# EAGLE design rack (EAGLE 7.2.0)
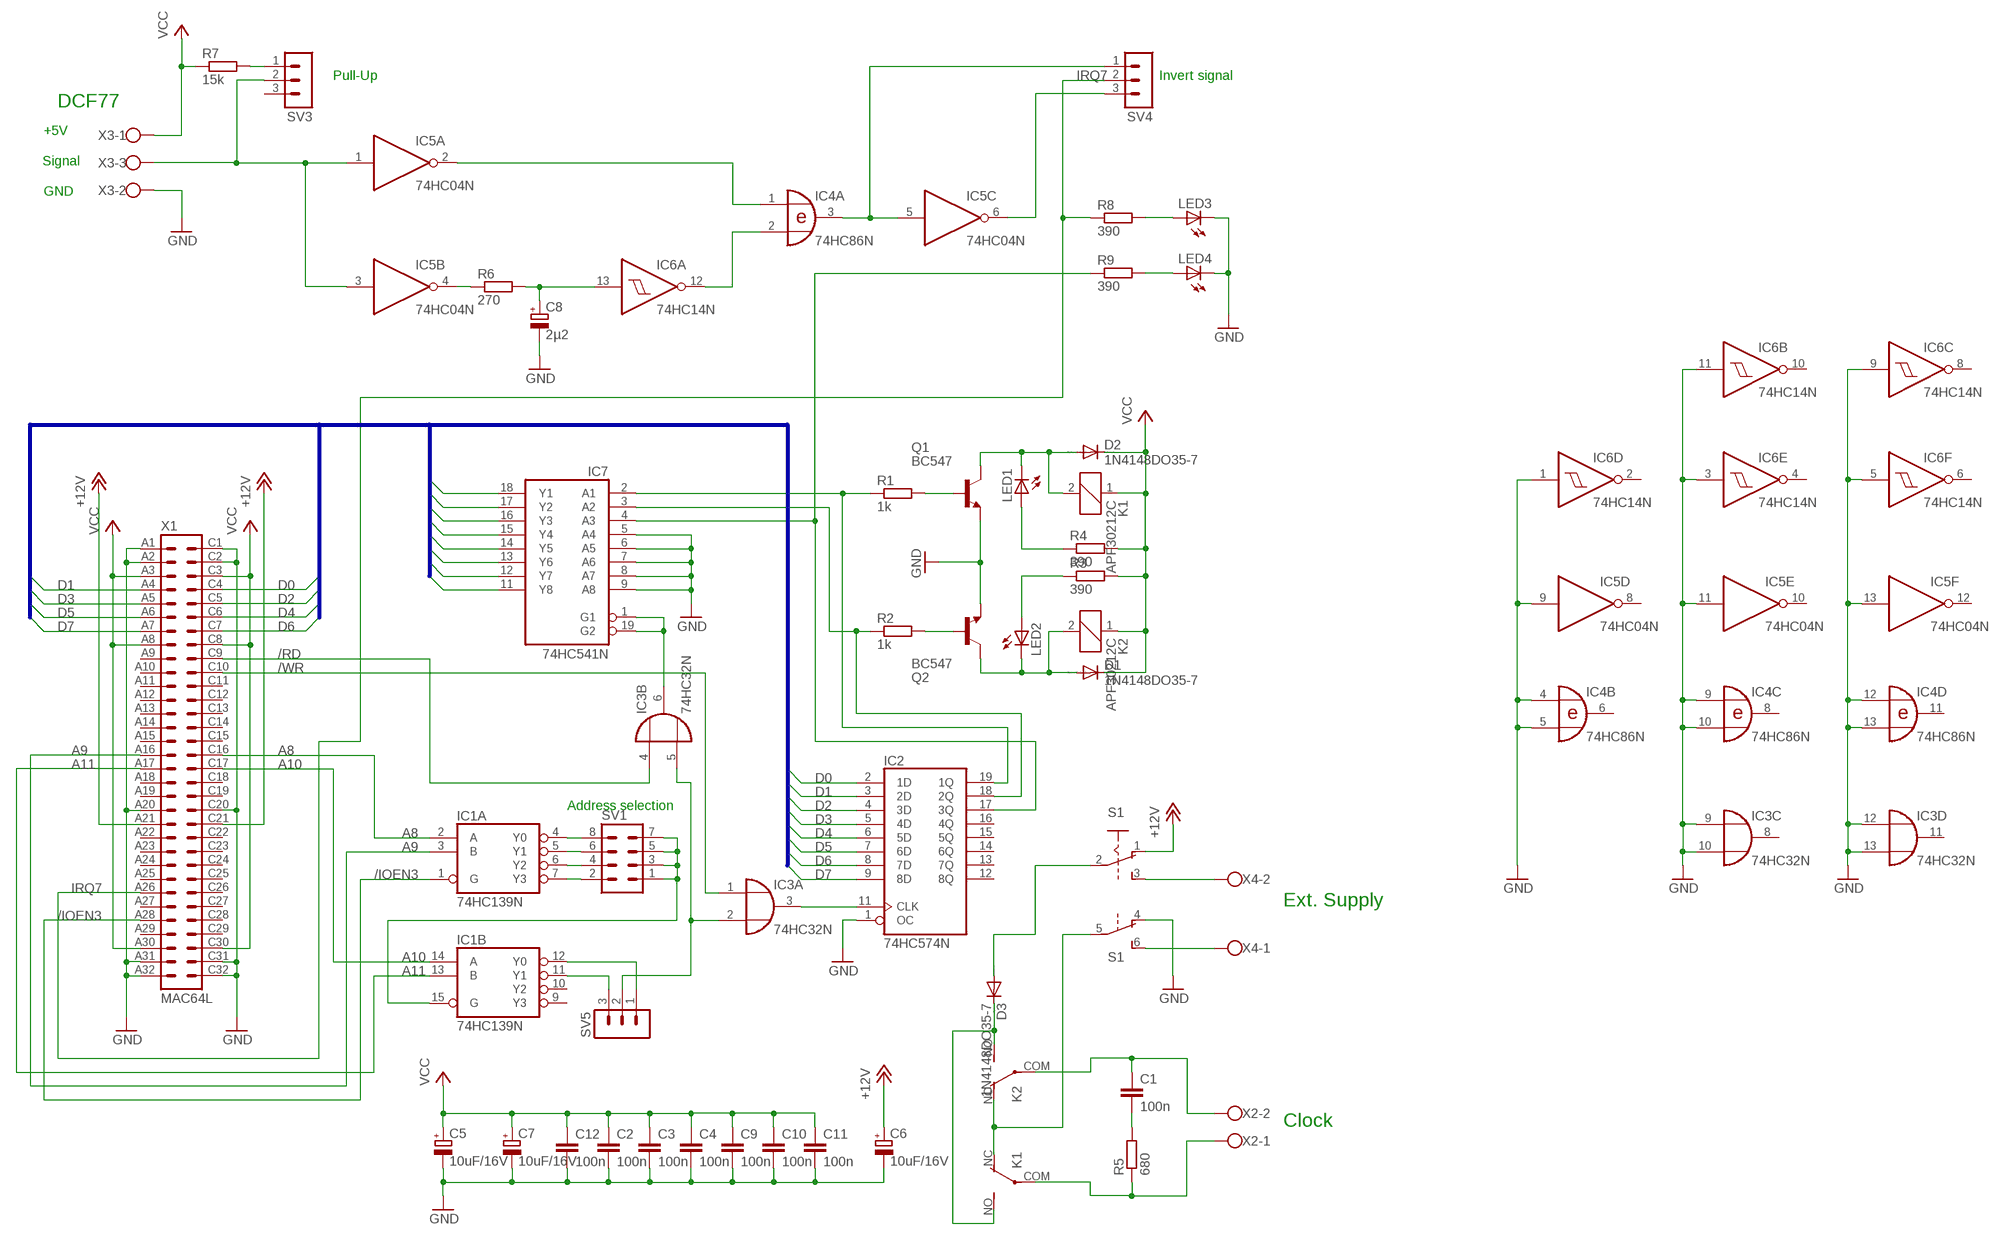
[diagram p0: schematic, sheet 1]

## Parts
C1  100n  C-EU050-024X044  [C050-024X044]
C2  100n  C-EU050-024X044  [C050-024X044]
C3  100n  C-EU050-024X044  [C050-024X044]
C4  100n  C-EU050-024X044  [C050-024X044]
C5  10uF/16V  CPOL-EUTT2D5  [TT2D5]
C6  10uF/16V  CPOL-EUTT2D5  [TT2D5]
C7  10uF/16V  CPOL-EUTT2D5  [TT2D5]
C8  2µ2  CPOL-EUE2,5-6E  [E2,5-6E]
C9  100n  C-EU050-024X044  [C050-024X044]
C10  100n  C-EU050-024X044  [C050-024X044]
C11  100n  C-EU050-024X044  [C050-024X044]
C12  100n  C-EU050-024X044  [C050-024X044]
D1  1N4148DO35-7  [DO35-7]
D2  1N4148DO35-7  [DO35-7]
D3  1N4148DO35-7  [DO35-7]
IC1  74HC139N  [DIL16]
IC2  74HC574N  [DIL20]
IC3  74HC32N  [DIL14]
IC4  74HC86N  [DIL14]
IC5  74HC04N  [DIL14]
IC6  74HC14N  [DIL14]
IC7  74HC541N  [DIL20]
K1  APF30212C  [APF30212C]
K2  APF30212C  [APF30212C]
LED1  LEDB155  [Q62902-B155]
LED2  LEDB155  [Q62902-B155]
LED3  LEDB155  [Q62902-B155]
LED4  LEDB155  [Q62902-B155]
Q1  BC547  [TO92]
Q2  BC547  [TO92]
R1  1k  R-EU_0204/7  [0204/7]
R2  1k  R-EU_0204/7  [0204/7]
R3  390  R-EU_0204/7  [0204/7]
R4  390  R-EU_0204/7  [0204/7]
R5  680  R-EU_0204/7  [0204/7]
R6  270  R-EU_0204/7  [0204/7]
R7  15k  R-EU_0204/7  [0204/7]
R8  390  R-EU_0204/7  [0204/7]
R9  390  R-EU_0204/7  [0204/7]
S1  A68-A31  [A68-A31]
SV1  MA04-2  [MA04-2]
SV3  MA03-1  [MA03-1]
SV4  MA03-1  [MA03-1]
SV5  MA03-1  [MA03-1]
X1  MAC64L  [MAC64L]
X2  W237-102  [W237-102]
X3  W237-103  [W237-103]
X4  W237-102  [W237-102]

## Nets
+12V: C6.+ S1.1(A:O) X1.A21 X1.C21
/IOEN3: IC1.1(A:G) X1.A28
/RD: IC3.4(B:I0) X1.C9
/WR: IC3.1(A:I0) X1.C10
A8: IC1.2(A:A) X1.C16
A9: IC1.3(A:B) X1.A16
A10: IC1.14(B:A) X1.C17
A11: IC1.13(B:B) X1.A17
D0: IC2.2(1D) IC7.18(Y1) X1.C4
D1: IC2.3(2D) IC7.17(Y2) X1.A4
D2: IC2.4(3D) IC7.16(Y3) X1.C5
D3: IC2.5(4D) IC7.15(Y4) X1.A5
D4: IC2.6(5D) IC7.14(Y5) X1.C6
D5: IC2.7(6D) IC7.13(Y6) X1.A6
D6: IC2.8(7D) IC7.12(Y7) X1.C7
D7: IC2.9(8D) IC7.11(Y8) X1.A7
GND: C2.2 C3.2 C4.2 C5.- C6.- C7.- C8.- C9.2 C10.2 C11.2 C12.2 IC2.1(OC) IC3.9(C:I0) IC3.10(C:I1) IC3.12(D:I0) IC3.13(D:I1) IC4.4(B:I0) IC4.5(B:I1) IC4.9(C:I0) IC4.10(C:I1) IC4.12(D:I0) IC4.13(D:I1) IC5.9(D:I) IC5.11(E:I) IC5.13(F:I) IC6.1(D:I) IC6.3(E:I) IC6.5(F:I) IC6.9(C:I) IC6.11(B:I) IC7.5(A4) IC7.6(A5) IC7.7(A6) IC7.8(A7) IC7.9(A8) LED3.K(C) LED4.K(C) Q1.1(E) Q2.1(E) S1.4(B:O) X1.A1 X1.A2 X1.A20 X1.A31 X1.A32 X1.C1 X1.C2 X1.C20 X1.C31 X1.C32 X3.2
IRQ7: R8.1 SV4.2 X1.A26
N$1: IC1.4(A:Y0) SV1.8
N$2: IC1.5(A:Y1) SV1.6
N$3: IC1.6(A:Y2) SV1.4
N$4: IC1.7(A:Y3) SV1.2
N$5: IC2.17(3Q) IC7.4(A3) R9.1
N$6: IC1.11(B:Y1) SV5.3
N$7: IC1.12(B:Y0) SV5.1
N$8: IC1.15(B:G) SV1.1 SV1.3 SV1.5 SV1.7
N$9: IC2.11(CLK) IC3.3(A:O)
N$10: Q1.2(B) R1.2
N$11: IC2.19(1Q) IC7.2(A1) R1.1
N$12: IC2.18(2Q) IC7.3(A2) R2.1
N$13: Q2.2(B) R2.2
N$14: D2.A K1.2 LED1.K(C) Q1.3(C)
N$15: C1.2 R5.2
N$16: D1.A K2.2 LED2.K(C) Q2.3(C)
N$17: C1.1 K2.COM(2:P) X2.2
N$18: LED1.A R4.1
N$19: LED2.A R3.1
N$20: K1.COM(2:P) R5.1 X2.1
N$21: D3.C K1.NO(2:S) K2.NO(2:S)
N$22: IC5.4(B:O) R6.1
N$23: C8.+ IC6.13(A:I) R6.2
N$24: IC4.1(A:I0) IC5.2(A:O)
N$25: IC4.2(A:I1) IC6.12(A:O)
N$26: IC4.3(A:O) IC5.5(C:I) SV4.1
N$27: K1.NC(2:O) K2.NC(2:O) S1.5(B:P)
N$28: R7.2 SV3.1
N$29: IC5.1(A:I) IC5.3(B:I) SV3.2 X3.3
N$30: IC5.6(C:O) SV4.3
N$31: LED3.A R8.2
N$32: S1.3(A:S) X4.2
N$33: S1.6(B:S) X4.1
N$34: D3.A S1.2(A:P)
N$35: IC3.6(B:O) IC7.1(G1) IC7.19(G2)
N$36: IC3.2(A:I1) IC3.5(B:I1) SV5.2
N$37: LED4.A R9.2
VCC: C2.1 C3.1 C4.1 C5.+ C7.+ C9.1 C10.1 C11.1 C12.1 D1.C D2.C K1.1 K2.1 R3.2 R4.2 R7.1 X1.A3 X1.A8 X1.A30 X1.C3 X1.C8 X1.C30 X3.1
Unconnected: IC1.9(B:Y3) IC1.10(B:Y2) IC2.12(8Q) IC2.13(7Q) IC2.14(6Q) IC2.15(5Q) IC2.16(4Q) IC3.8(C:O) IC3.11(D:O) IC4.6(B:O) IC4.8(C:O) IC4.11(D:O) IC5.8(D:O) IC5.10(E:O) IC5.12(F:O) IC6.2(D:O) IC6.4(E:O) IC6.6(F:O) IC6.8(C:O) IC6.10(B:O) SV3.3 X1.A9 X1.A10 X1.A11 X1.A12 X1.A13 X1.A14 X1.A15 X1.A18 X1.A19 X1.A22 X1.A23 X1.A24 X1.A25 X1.A27 X1.A29 X1.C11 X1.C12 X1.C13 X1.C14 X1.C15 X1.C18 X1.C19 X1.C22 X1.C23 X1.C24 X1.C25 X1.C26 X1.C27 X1.C28 X1.C29

## Buses
D[0..7]

## Notes on the sheet
- Pull-Up | Invert signal
- DCF77
- +5V
- Signal
- GND
- Address selection
- Ext. Supply
- Clock

## Power pins joined to a net without a drawn wire
GND: IC1.8(P:GND) IC2.10(GND) IC3.7(P:GND) IC4.7(P:GND) IC5.7(P:GND) IC6.7(P:GND) IC7.10(GND)
VCC: IC1.16(P:VCC) IC2.20(VCC) IC3.14(P:VCC) IC4.14(P:VCC) IC5.14(P:VCC) IC6.14(P:VCC) IC7.20(VCC)

## Library data of the parts
C1-C4 C9-C12 = rcl:C-EU: CAPACITOR, European symbol
C5-C8 = rcl:CPOL-EU: POLARIZED CAPACITOR, European symbol
D1-D3 = diode:1N4148: DIODE high speed (Philips)
IC1 = 74xx-eu:74*139: Dual 2-line to 4-line DECODER/DEMULTIPLEXER
IC2 = 74xx-eu:74*574: 8-bit D type FLIP FLOP bus driver
IC3 = 74xx-eu:74*32: Quad 2-input OR gate
IC4 = 74xx-eu:74*86: Quad 2-input EXCLUSIVE-OR (XOR) gate
IC5 = 74xx-eu:74*04: Hex INVERTER
IC6 = 74xx-eu:74*14: Hex schmitt trigger INVERTER
IC7 = 74xx-eu:74*541: Octal BUFFER and LINE DRIVER, 3-state
K1 K2 = relay:APF30212C: Compliant with European standards 1a/1c 6A Slim power relays Source: Data sheet <http://pewa.panasonic.com/assets/pcsd/catalog/pf-catalog.pdf>; OC_FARNELL: unknown
LED1-LED4 = led:LED: LED OSRAM: - CHIPLED LG R971, LG N971, LY N971, LG Q971, LY Q971, LO R971, LY R971 LH N974, LH R974 LS Q976, LO Q976, LY Q976 LO Q996 - Hyper CHIPLED LW Q18S LB Q993, LB Q99A, LB R99A - SideLED LS A670, LO A670, LY A670, LG A670, LP A670 LB A673, LV A673, LT A673, LW A673 LH A674 LY A675 LS A676, LA A676, LO A676, LY A676, LW A676 LS A679, LY A679, LG A679 - Hyper Micro SIDELED® LS Y876, LA Y876, LO Y876, LY Y876 LT Y87S - SmartLED LW L88C, LW L88S LB L89C, LB L89S, LG L890 LS L89K, LO L89K, LY L89K LS L896, LA L896, LO L896, LY L896 - TOPLED LS T670, LO T670, LY T670, LG T670, LP T670 LSG T670, LSP T670, LSY T670, LOP T670, LYG T670 LG T671, LOG T671, LSG T671 LB T673, LV T673, LT T673, LW T673 LH T674 LS T676, LA T676, LO T676, LY T676, LB T676, LH T676, LSB T676, LW T676 LB T67C, LV T67C, LT T67C, LS T67K, LO T67K, LY T67K, LW E67C LS E67B, LA E67B, LO E67B, LY E67B, LB E67C, LV E67C, LT E67C LW T67C LS T679, LY T679, LG T679 LS T770, LO T770, LY T770, LG T770, LP T770 LB T773, LV T773, LT T773, LW T773 LH T774 LS E675, LA E675, LY E675, LS T675 LS T776, LA T776, LO T776, LY T776, LB T776 LHGB T686 LT T68C, LB T68C - Hyper Mini TOPLED® LB M676 - Mini TOPLED Santana® LG M470 LS M47K, LO M47K, LY M47K Source: http://www.osram.convergy.de LUXEON: - LUMILED® LXK2-PW12-R00, LXK2-PW12-S00, LXK2-PW14-U00, LXK2-PW14-V00 LXK2-PM12-R00, LXK2-PM12-S00, LXK2-PM14-U00 LXK2-PE12-Q00, LXK2-PE12-R00, LXK2-PE12-S00, LXK2-PE14-T00, LXK2-PE14-U00 LXK2-PB12-K00, LXK2-PB12-L00, LXK2-PB12-M00, LXK2-PB14-N00, LXK2-PB14-P00, LXK2-PB14-Q00 LXK2-PR12-L00, LXK2-PR12-M00, LXK2-PR14-Q00, LXK2-PR14-R00 LXK2-PD12-Q00, LXK2-PD12-R00, LXK2-PD12-S00 LXK2-PH12-R00, LXK2-PH12-S00 LXK2-PL12-P00, LXK2-PL12-Q00, LXK2-PL12-R00 Source: www.luxeon.com KINGBRIGHT: KA-3528ASYC Source: www.kingbright.com
Q1 Q2 = transistor-npn:BC547*: NPN Transistor
R1-R9 = rcl:R-EU_: RESISTOR, European symbol
S1 = switch:A68-A31: SLIDING SWITCH Siemens, distributor Buerklin, 11G766
SV1 = con-lstb:MA04-2: PIN HEADER; OC_FARNELL: unknown; OC_NEWARK: unknown
SV3-SV5 = con-lstb:MA03-1: PIN HEADER; OC_FARNELL: unknown; OC_NEWARK: unknown
X1 = con-vg:MAC64L: CONNECTOR male, 64 pins, block, type C, rows AC, grid 5.08 mm
X2 X4 = con-wago-500:W237-102: WAGO SCREW CLAMP; MPN: 237-102; OC_FARNELL: unknown; OC_NEWARK: 70K9898
X3 = con-wago-500:W237-103: WAGO SCREW CLAMP; MPN: 237-103; OC_FARNELL: unknown; OC_NEWARK: 18M7116

## Board
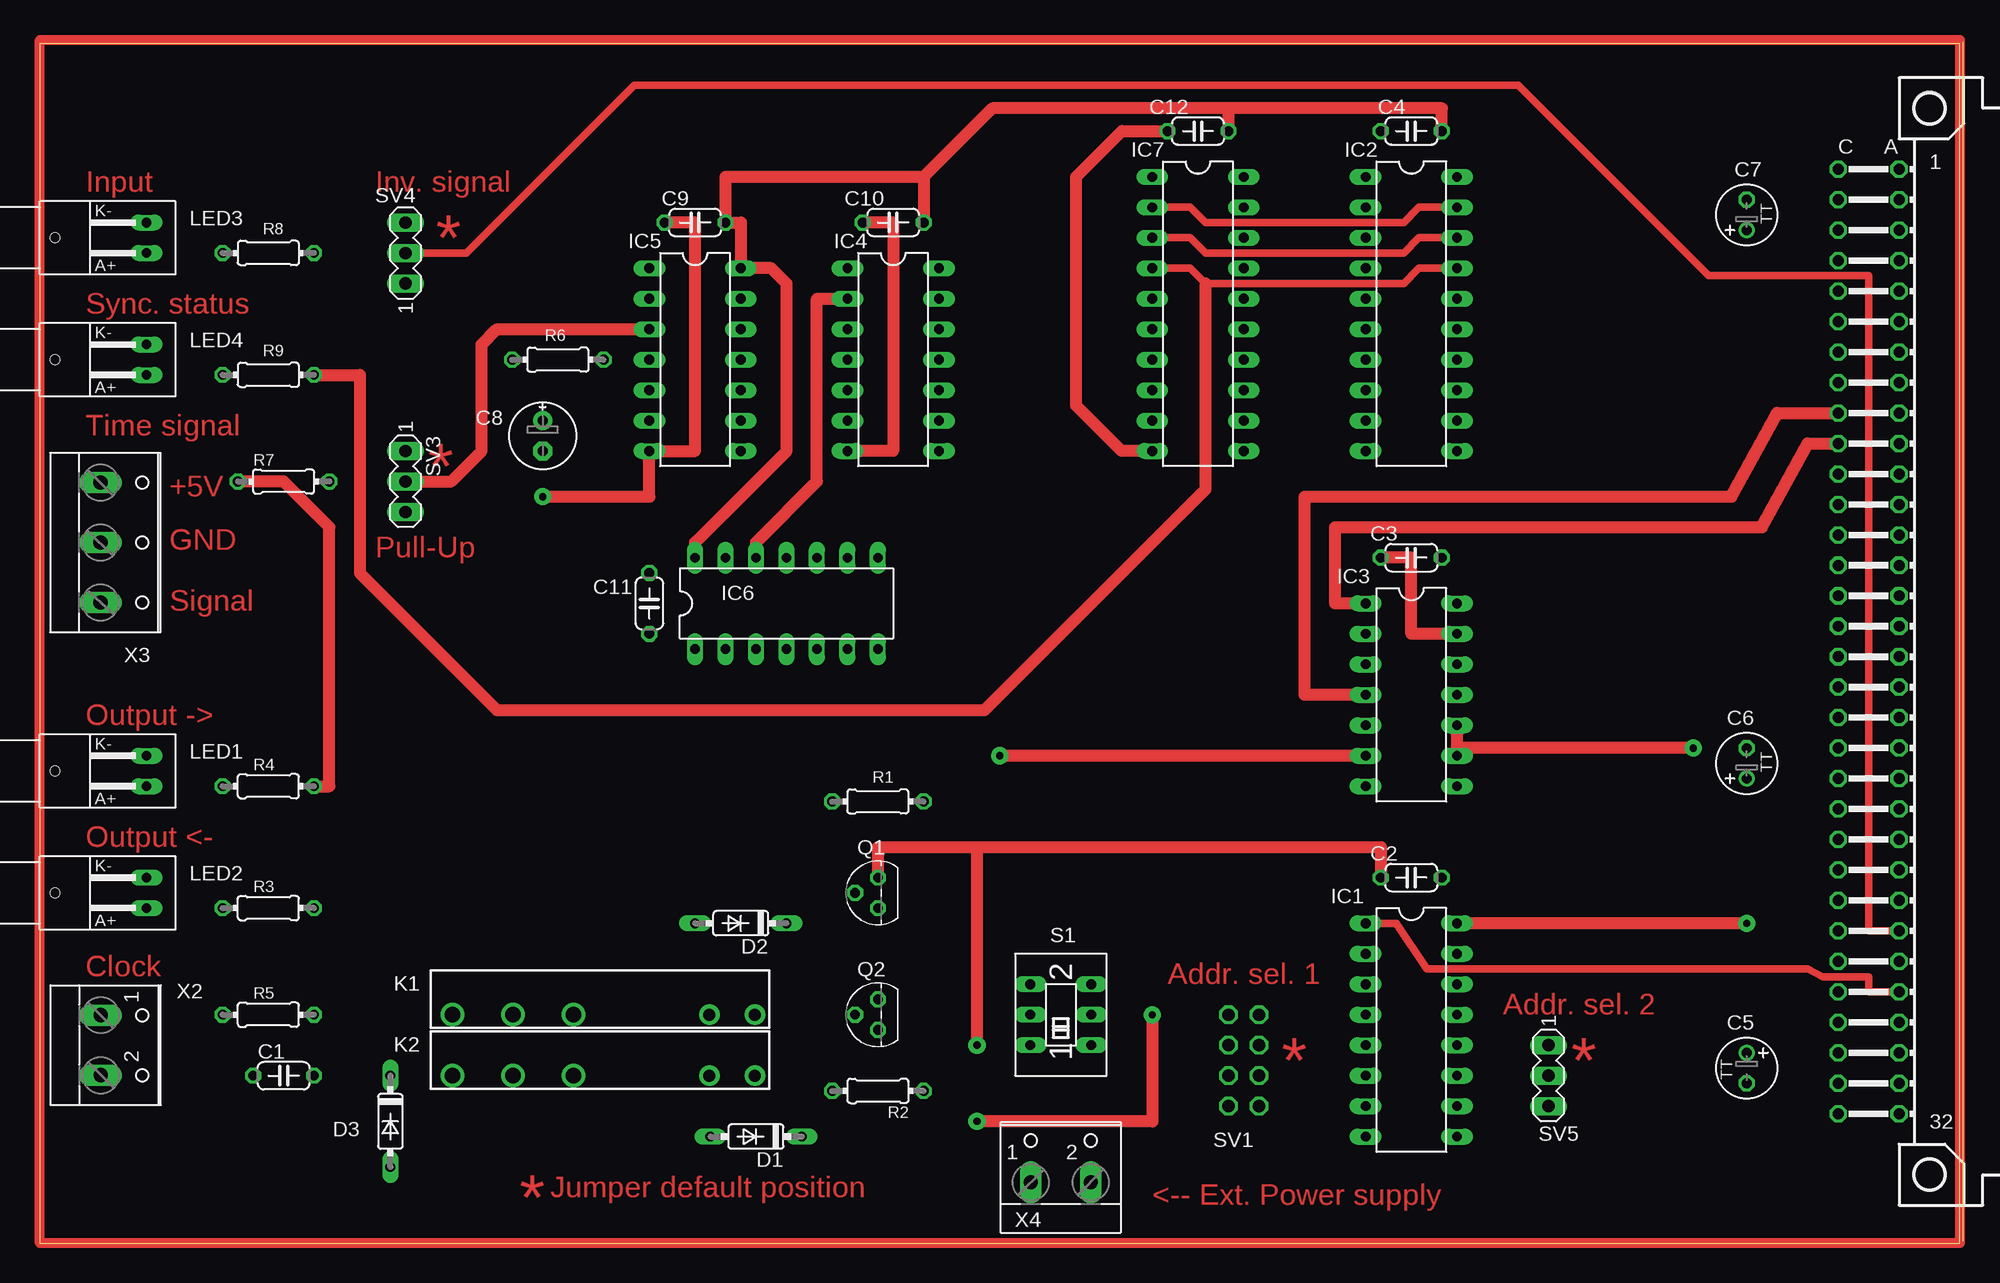
[diagram p1: board, top side]
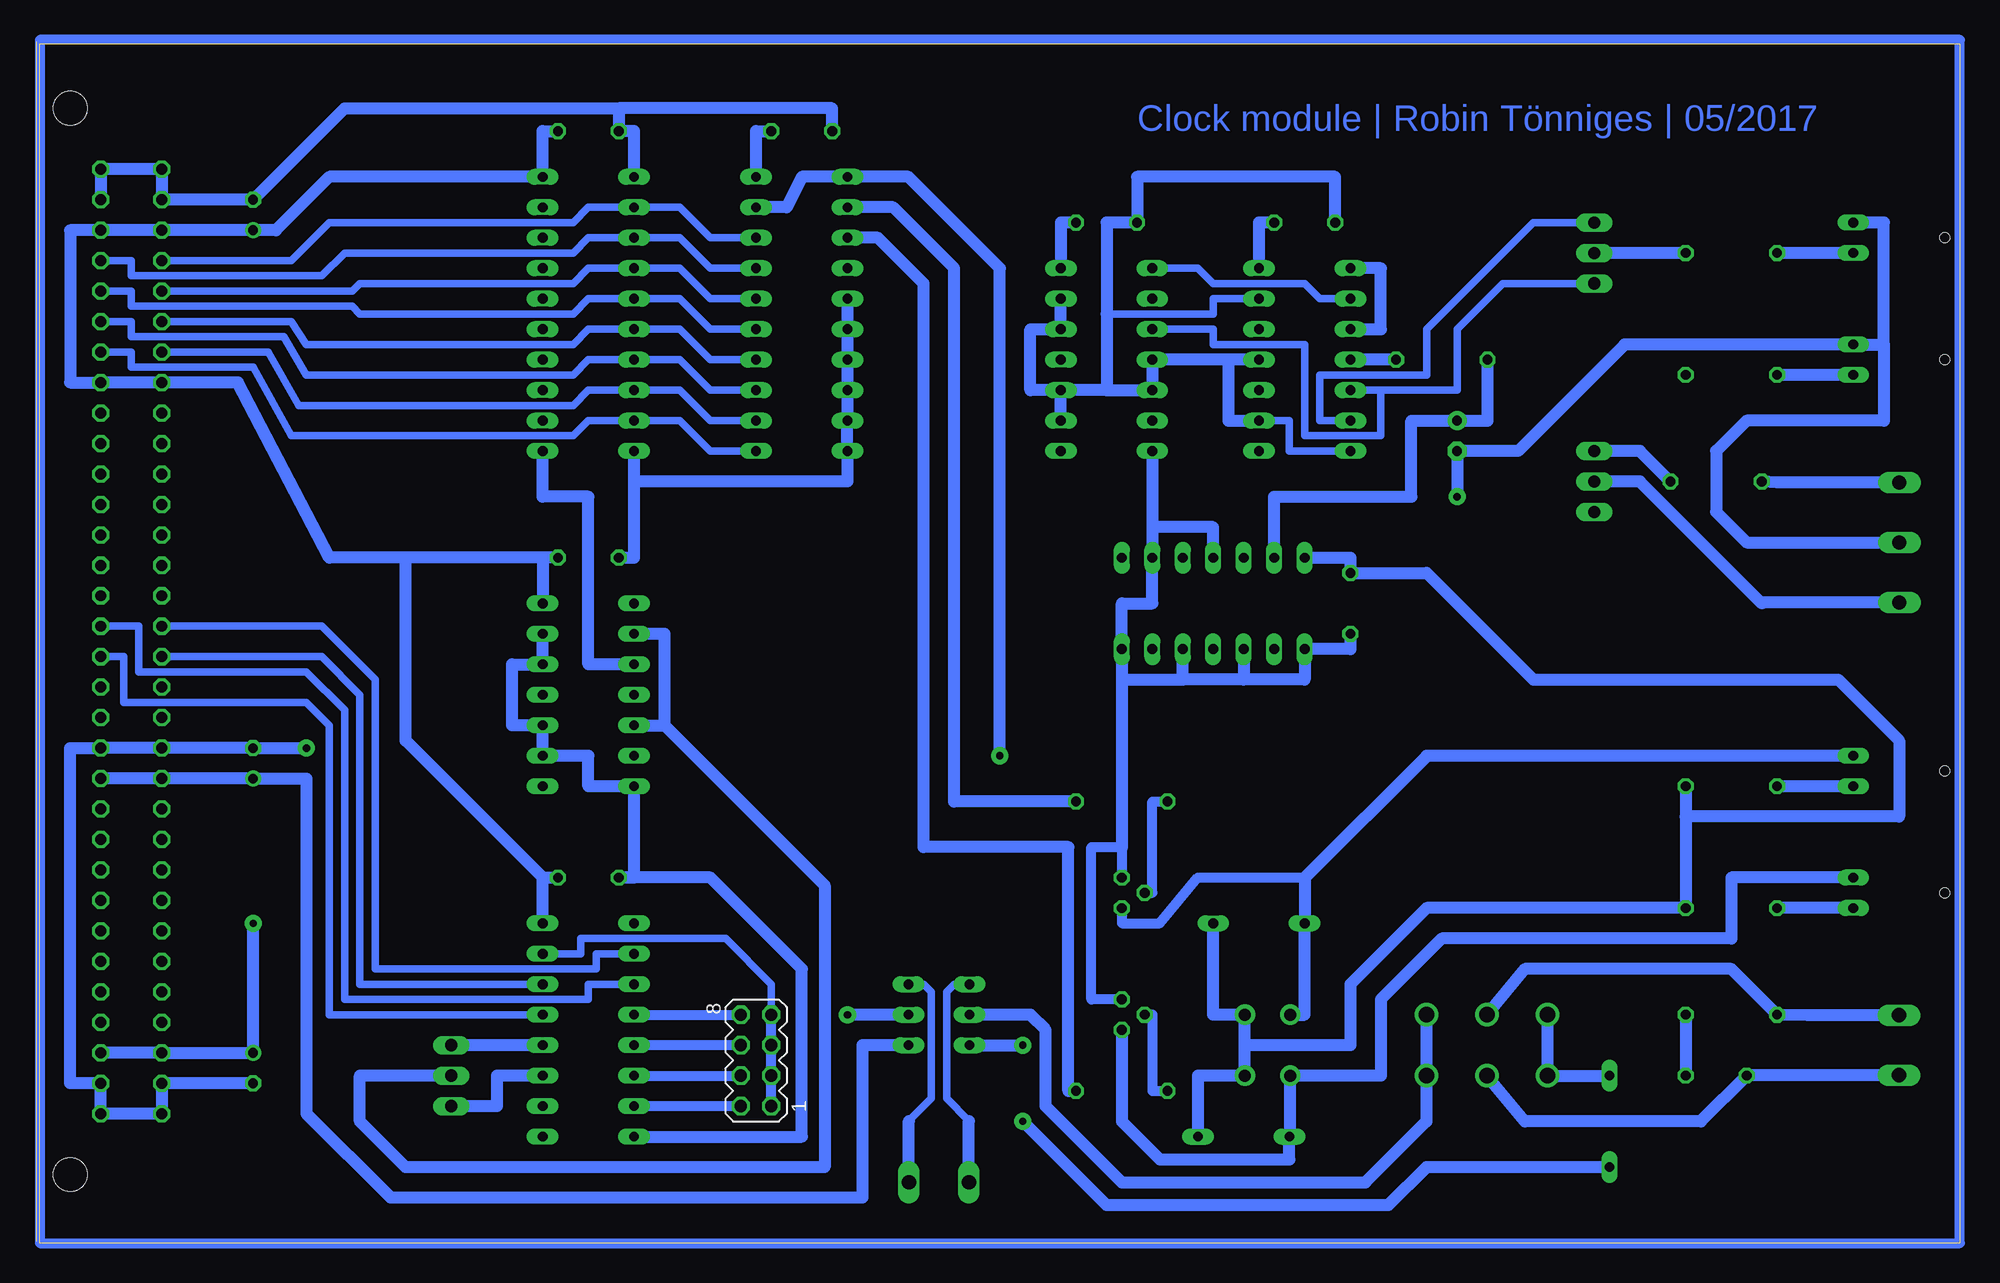
[diagram p2: board, bottom side, seen from below]

Size 160 x 100 mm. Coordinates in mm from the lower left corner, seen from the top.
Outline: 0,0 160,0 160,100 0,100 0,0
Copper layers (1*16): Top 0.035mm / dielectric 1.5mm / Bottom 0.035mm
Design rules "default": minimum track width 10mil, minimum drill 24mil, track to track 8mil, track to pad 8mil, pad to pad 8mil, via to via 8mil, smd to smd 8mil, copper to edge 40mil, drill to drill 8mil, minimum pad ring 10mil, minimum via ring 8mil, stop-mask expansion 4mil, vias tented up to drill 0mil, thermal gap 10mil

### Footprints (pad centres in the part's own frame; a part is rotated, then mirrored left to right if it is on the bottom)
C050-024X044 = drill 0.813 octagon: 1 -2.54,0; 2 2.54,0
TT2D5 = drill 0.813: + -1.27,0 | drill 0.813 octagon: - 1.27,0
E2,5-6E = drill 0.813 pad 1.575: + -1.27,0 | drill 0.813 pad 1.575 octagon: - 1.27,0
DO35-7 = drill 0.813 long: A 3.81,0; C -3.81,0
DIL16 = drill 0.813 long: 1 -8.89,-3.81; 2 -6.35,-3.81; 3 -3.81,-3.81; 4 -1.27,-3.81; 5 1.27,-3.81; 6 3.81,-3.81; 7 6.35,-3.81; 8 8.89,-3.81; 9 8.89,3.81; 10 6.35,3.81; 11 3.81,3.81; 12 1.27,3.81; 13 -1.27,3.81; 14 -3.81,3.81; 15 -6.35,3.81; 16 -8.89,3.81
DIL20 = drill 0.813 long: 1 -11.43,-3.81; 2 -8.89,-3.81; 3 -6.35,-3.81; 4 -3.81,-3.81; 5 -1.27,-3.81; 6 1.27,-3.81; 7 3.81,-3.81; 8 6.35,-3.81; 9 8.89,-3.81; 10 11.43,-3.81; 11 11.43,3.81; 12 8.89,3.81; 13 6.35,3.81; 14 3.81,3.81; 15 1.27,3.81; 16 -1.27,3.81; 17 -3.81,3.81; 18 -6.35,3.81; 19 -8.89,3.81; 20 -11.43,3.81
DIL14 = drill 0.813 long: 1 -7.62,-3.81; 2 -5.08,-3.81; 3 -2.54,-3.81; 4 0,-3.81; 5 2.54,-3.81; 6 5.08,-3.81; 7 7.62,-3.81; 8 7.62,3.81; 9 5.08,3.81; 10 2.54,3.81; 11 0,3.81; 12 -2.54,3.81; 13 -5.08,3.81; 14 -7.62,3.81
APF30212C = drill 1 pad 1.7: 1 -12.6,0; 2 -8.82,0 | drill 1.3 pad 1.9: COM 7.56,0; NC 2.52,0; NO 12.6,0
Q62902-B155 = drill 0.813 long: A 7.62,-1.27; K 7.62,1.27 | hole 0.813: 0,0
TO92 = drill 0.813 octagon: 1 1.27,0; 2 0,1.905; 3 -1.27,0
0204/7 = drill 0.813 octagon: 1 -3.81,0; 2 3.81,0
A68-A31 = drill 0.813 long: 1 -2.54,-2.54; 2 0,-2.54; 3 2.54,-2.54; 4 -2.54,2.54; 5 0,2.54; 6 2.54,2.54
MA04-2 = drill 1.016 octagon: 1 -3.81,-1.27; 2 -3.81,1.27; 3 -1.27,-1.27; 4 -1.27,1.27; 5 1.27,-1.27; 6 1.27,1.27; 7 3.81,-1.27; 8 3.81,1.27
MA03-1 = drill 1.016 long: 1 -2.54,0; 2 0,0; 3 2.54,0
MAC64L = drill 0.914 octagon: A1 -2.54,39.37; A2 -2.54,36.83; A3 -2.54,34.29; A4 -2.54,31.75; A5 -2.54,29.21; A6 -2.54,26.67; A7 -2.54,24.13; A8 -2.54,21.59; A9 -2.54,19.05; A10 -2.54,16.51; A11 -2.54,13.97; A12 -2.54,11.43; A13 -2.54,8.89; A14 -2.54,6.35; A15 -2.54,3.81; A16 -2.54,1.27; A17 -2.54,-1.27; A18 -2.54,-3.81; A19 -2.54,-6.35; A20 -2.54,-8.89; A21 -2.54,-11.43; A22 -2.54,-13.97; A23 -2.54,-16.51; A24 -2.54,-19.05; A25 -2.54,-21.59; A26 -2.54,-24.13; A27 -2.54,-26.67; A28 -2.54,-29.21; A29 -2.54,-31.75; A30 -2.54,-34.29; A31 -2.54,-36.83; A32 -2.54,-39.37; C1 -7.62,39.37; C2 -7.62,36.83; C3 -7.62,34.29; C4 -7.62,31.75; C5 -7.62,29.21; C6 -7.62,26.67; C7 -7.62,24.13; C8 -7.62,21.59; C9 -7.62,19.05; C10 -7.62,16.51; C11 -7.62,13.97; C12 -7.62,11.43; C13 -7.62,8.89; C14 -7.62,6.35; C15 -7.62,3.81; C16 -7.62,1.27; C17 -7.62,-1.27; C18 -7.62,-3.81; C19 -7.62,-6.35; C20 -7.62,-8.89; C21 -7.62,-11.43; C22 -7.62,-13.97; C23 -7.62,-16.51; C24 -7.62,-19.05; C25 -7.62,-21.59; C26 -7.62,-24.13; C27 -7.62,-26.67; C28 -7.62,-29.21; C29 -7.62,-31.75; C30 -7.62,-34.29; C31 -7.62,-36.83; C32 -7.62,-39.37 | hole 2.794: 0,44.45; 0,-44.45
W237-102 = drill 1.194 long: 1 -2.5,-1.27; 2 2.5,-1.27
W237-103 = drill 1.194 long: 1 -5,-1.29; 2 0,-1.29; 3 5,-1.29

### Placement (x,y rotation side)
C1  20.32,13.97 0 top
C2  114.3,30.48 180 top
C3  114.3,57.15 180 top
C4  114.3,92.71 180 top
C5  142.24,14.61 270 top
C6  142.24,40.01 90 top
C7  142.24,85.72 90 top
C8  41.91,67.31 270 top
C9  54.61,85.09 180 top
C10  71.12,85.09 180 top
C11  50.8,53.34 270 top
C12  96.52,92.71 180 top
D1  59.69,8.89 180 top
D2  58.42,26.67 180 top
D3  29.21,10.16 270 top
IC1  114.3,17.78 270 top
IC2  114.3,77.47 270 top
IC3  114.3,45.72 270 top
IC4  71.12,73.66 270 top
IC5  54.61,73.66 270 top
IC6  62.23,53.34 0 top
IC7  96.52,77.47 270 top
K1  46.99,19.05 180 top
K2  46.99,13.97 180 top
LED1  1.27,39.37 0 top
LED2  1.27,29.21 0 top
LED3  1.27,83.82 0 top
LED4  1.27,73.66 0 top
Q1  69.85,29.21 90 top
Q2  69.85,19.05 90 top
R1  69.85,36.83 180 top
R2  69.85,12.7 180 top
R3  19.05,27.94 0 top
R4  19.05,38.1 0 top
R5  19.05,19.05 0 top
R6  43.18,73.66 180 top
R7  20.32,63.5 0 top
R8  19.05,82.55 180 top
R9  19.05,72.39 180 top
S1  85.09,19.05 90 top
SV1  100.33,15.24 90 bottom
SV3  30.48,63.5 270 top
SV4  30.48,82.55 90 top
SV5  125.73,13.97 270 top
X1  157.48,50.16 0 top
X2  6.35,16.51 270 top
X3  6.35,58.42 270 top
X4  85.09,6.35 0 top

### Tracks (layer width: path | path; a pad name or v marks a point on that pad's centre or on a via)
+12V
  Bottom 1.016: X1.A21 X1.C21 C6.+ 137.79,38.73 137.79,10.79 130.81,3.81 91.44,3.81 91.44,16.51 S1.1
/IOEN3
  Top 0.61: IC1.1 113.03,26.67 115.57,22.86 147.32,22.86 148.59,22.23 152.4,22.23 152.4,20.95 X1.A28
/RD
  Top 1.016: IC3.4 105.41,45.72 105.41,62.23 140.97,62.23 144.78,69.22 X1.C9
/WR
  Top 1.016: IC3.1 107.95,53.34 107.95,59.69 143.51,59.69 147.32,66.67 X1.C10
A8
  Bottom 0.61: IC1.2 113.67,24.13 113.67,22.86 132.08,22.86 132.08,46.99 136.53,51.44 X1.C16
A9
  Bottom 0.61: IC1.3 114.3,21.59 114.3,20.32 134.62,20.32 134.62,44.45 137.79,47.62 151.76,47.62 151.76,51.44 X1.A16
A10
  Bottom 0.61: IC1.14 133.35,21.59 133.35,45.72 136.53,48.9 X1.C17
A11
  Bottom 0.61: IC1.13 135.89,19.05 135.89,43.18 137.79,45.09 153.03,45.09 153.03,48.9 X1.A17
D0
  Bottom 0.61: X1.C4 139.06,81.92 135.89,85.09 115.57,85.09 114.3,86.36 IC2.2 106.68,86.36 104.14,83.82 IC7.18
D1
  Bottom 0.61: X1.A4 152.4,81.92 152.4,80.64 136.53,80.64 134.62,82.55 115.57,82.55 114.3,83.82 IC2.3 106.68,83.82 104.14,81.28 IC7.17
D2
  Bottom 0.61: X1.C5 133.99,79.38 133.35,80.01 115.57,80.01 114.3,81.28 IC2.4 106.68,81.28 104.14,78.74 IC7.16
D3
  Bottom 0.61: X1.A5 152.4,79.38 152.4,78.11 133.99,78.11 133.35,77.47 115.57,77.47 114.3,78.74 IC2.5 106.68,78.74 104.14,76.2 IC7.15
D4
  Bottom 0.61: X1.C6 139.06,76.83 137.79,74.93 115.57,74.93 114.3,76.2 IC2.6 106.68,76.2 104.14,73.66 IC7.14
D5
  Bottom 0.61: X1.A6 152.4,76.83 152.4,75.56 139.7,75.56 137.79,72.39 115.57,72.39 114.3,73.66 IC2.7 106.68,73.66 104.14,71.12 IC7.13
D6
  Bottom 0.61: X1.C7 140.97,74.3 138.43,69.85 115.57,69.85 114.3,71.12 IC2.8 106.68,71.12 104.14,68.58 IC7.12
D7
  Bottom 0.61: X1.A7 152.4,74.3 152.4,73.03 142.24,73.03 139.06,67.31 115.57,67.31 114.3,68.58 IC2.9 106.68,68.58 104.14,66.04 IC7.11
GND  (via drill 0.6 pad 1.42)
  Top 1.016: Q1.1 69.85,33.02 78.11,33.02 | IC7.10 90.17,66.04 86.36,69.85 86.36,88.9 90.17,92.71 C12.2 | v137.79,41.27 118.11,41.27 IC3.10 | v41.91,62.23 50.8,62.23 IC5.7 54.61,66.04 54.61,85.09 C9.2 | IC3.13 114.3,50.8 114.3,57.15 C3.2 | 78.11,33.02 111.76,33.02 C2.2 | v78.11,16.51 78.11,33.02 | C10.2 71.12,85.09 71.12,66.04 IC4.7
  Bottom 0.61: IC5.7 55.88,66.04 55.88,68.58 IC5.9 59.69,68.58 | IC5.11 60.96,73.66 | 71.12,77.47 62.23,77.47 62.23,78.74 IC5.13
  Bottom 0.813: Q2.1 72.39,20.32 72.39,33.02 69.85,33.02 Q1.1
  Bottom 1.016: X1.A2 X1.A1 X1.C1 X1.C2 C7.- 134.62,94.61 111.76,94.61 | C5.- X1.C31 X1.C32 X1.A32 X1.A31 157.48,13.34 157.48,41.27 X1.A20 X1.C20 C6.- v137.79,41.27 | 111.76,94.61 C4.2 110.49,92.71 IC2.1 | C3.2 110.49,57.15 110.49,63.5 | 110.49,63.5 IC2.10 | IC3.13 IC3.12 120.65,48.26 120.65,43.18 IC3.10 IC3.9 114.3,40.64 114.3,38.1 IC3.7 110.49,30.48 C2.2 104.14,30.48 96.52,22.86 96.52,8.89 IC1.8 | IC5.11 IC4.4 IC4.5 71.12,71.12 | 60.96,73.66 60.96,68.58 IC5.9 | IC4.9 IC4.10 | IC4.10 77.47,71.12 77.47,76.2 IC4.12 IC4.13 | C11.2 50.8,49.53 IC6.1 54.61,46.99 59.69,46.99 | 69.85,46.99 IC6.7 69.85,53.34 67.31,53.34 IC6.9 67.31,59.69 | 69.85,46.99 64.77,46.99 | 64.77,46.99 IC6.5 | IC6.3 59.69,46.99 | 59.69,46.99 64.77,46.99 | IC6.11 62.23,59.69 67.31,59.69 | IC4.7 67.31,59.69 | 69.85,46.99 69.85,33.02 | 110.49,63.5 92.71,63.5 IC7.10 IC7.9 IC7.8 IC7.7 IC7.6 IC7.5 | v41.91,62.23 C8.- 36.83,66.04 27.94,74.93 LED4.K 6.35,74.93 | 6.35,74.93 6.35,85.09 LED3.K | 6.35,74.93 6.35,68.58 17.78,68.58 20.32,66.04 20.32,60.96 17.78,58.42 X3.2 | S1.4 v78.11,16.51 | 71.12,71.12 71.12,77.47 71.12,85.09 C10.2 68.58,88.9 52.07,88.9 C9.2 | 71.12,71.12 IC4.10 | C12.2 93.98,94.61 111.76,94.61
IRQ7
  Top 0.61: SV4.2 35.56,82.55 49.53,96.52 123.19,96.52 139.06,80.64 152.4,80.64 152.4,26.04 X1.A26
  Bottom 1.016: R8.1 SV4.2
N$1
  Bottom 0.813: IC1.4 SV1.8
N$2
  Bottom 0.813: SV1.6 IC1.5
N$3
  Bottom 0.813: IC1.6 SV1.4
N$4
  Bottom 0.813: SV1.2 IC1.7
N$5
  Top 0.61: IC2.17 114.94,81.28 113.67,80.01 97.16,80.01 95.89,81.28 IC7.4
  Top 1.016: R9.1 26.67,72.39 26.67,55.88 38.1,44.45 78.74,44.45 97.16,62.87 97.16,80.01
N$6
  Bottom 1.016: IC1.11 121.92,13.97 121.92,11.43 SV5.3
N$7
  Bottom 1.016: IC1.12 SV5.1
N$8
  Bottom 0.61: IC1.15 114.94,24.13 114.94,25.4 102.87,25.4 99.06,21.59 SV1.7
  Bottom 0.813: SV1.1 SV1.3 SV1.5 SV1.7
N$9
  Bottom 1.016: IC3.3 114.3,48.26 114.3,62.23 118.11,62.23 IC2.11
N$10
  Bottom 0.813: Q1.2 67.31,29.21 67.31,36.83 R1.2
N$11
  Top 0.61: IC7.2 95.89,86.36 97.16,85.09 113.67,85.09 114.94,86.36 IC2.19
  Bottom 1.016: R1.1 83.82,36.83 83.82,81.28 88.9,86.36 IC7.2
N$12
  Top 0.61: IC7.3 95.89,83.82 97.16,82.55 113.67,82.55 114.94,83.82 IC2.18
  Bottom 1.016: R2.1 74.3,12.7 74.3,33.02 86.36,33.02 86.36,80.01 90.17,83.82 IC7.3
N$13
  Bottom 0.813: Q2.2 67.31,19.05 67.31,12.7 R2.2
N$14
  Bottom 0.813: Q1.3 69.85,26.67 66.67,26.67 63.5,30.48 54.61,30.48
  Bottom 1.016: K1.2 54.61,19.05 D2.A 54.61,30.48 44.45,40.64 LED1.K
N$15
  Bottom 1.016: R5.2 C1.2
N$16
  Bottom 1.016: LED2.K 19.05,30.48 19.05,25.4 43.18,25.4 48.26,20.32 48.26,13.97 K2.2 55.81,8.89 D1.A 55.88,6.99 66.67,6.99 69.85,10.16 Q2.3
N$17
  Bottom 1.016: X2.2 17.78,14.01 C1.1 21.59,10.16 36.26,10.16 K2.COM
N$18
  Bottom 1.016: LED1.A R4.1
N$19
  Bottom 1.016: LED2.A R3.1
N$20
  Bottom 1.016: X2.1 12.7,19.01 R5.1 19.05,22.86 36.26,22.86 K1.COM
N$21
  Bottom 1.016: K1.NO K2.NO D3.C
N$22
  Bottom 1.016: R6.1 IC5.4
N$23
  Bottom 1.016: R6.2 39.37,68.58 C8.+ 45.72,68.58 45.72,62.23 57.15,62.23 IC6.13
N$24
  Bottom 0.61: IC5.2 53.34,78.74 54.61,80.01 62.23,80.01 63.5,81.28 IC4.1
N$25
  Top 1.016: IC6.12 59.69,58.42 64.77,63.5 64.77,78.74 IC4.2
N$26
  Bottom 0.61: IC5.5 48.26,71.12 | 48.26,71.12 41.91,71.12 41.91,76.2 38.1,80.01 SV4.1 | IC4.3 62.23,76.2 62.23,74.93 54.61,74.93 54.61,67.31 48.26,67.31 48.26,71.12
N$27
  Bottom 1.016: K1.NC K2.NC 44.47,10.16 49.55,5.08 69.85,5.08 76.2,11.43 76.2,17.78 77.47,19.05 S1.5
N$28
  Bottom 1.016: SV3.1 26.67,66.04 R7.2
N$29
  Top 1.016: SV3.2 34.29,63.5 36.83,66.04 36.83,74.93 38.1,76.2 IC5.3
  Bottom 1.016: IC5.3 48.26,76.2 48.26,81.28 IC5.1 | X3.3 16.43,53.42 16.51,53.34 26.67,63.5 SV3.2
N$30
  Bottom 0.61: IC5.6 53.34,68.58 53.34,72.39 44.45,72.39 44.45,76.2 35.56,85.09 SV4.3
N$31
  Bottom 1.016: LED3.A R8.2
N$32
  Bottom 0.61: 87.59,10.2 85.72,12.06 85.72,20.95 86.36,21.59 S1.3
  Bottom 1.016: X4.2 87.59,10.2
N$33
  Bottom 0.61: 82.59,10.2 84.45,12.06 84.45,20.95 83.82,21.59 S1.6
  Bottom 1.016: X4.1 82.59,10.2
N$34  (via drill 0.6 pad 1.42)
  Top 1.016: v92.71,19.05 92.71,10.16 v78.11,10.16
  Bottom 1.016: D3.A 44.45,6.35 47.62,3.17 71.12,3.17 v78.11,10.16 | S1.2 v92.71,19.05
N$35  (via drill 0.6 pad 1.42)
  Top 1.016: IC3.6 v80.01,40.64
  Bottom 1.016: IC7.19 97.79,86.36 96.52,88.9 IC7.1 87.63,88.9 80.01,81.28 v80.01,40.64
N$36
  Bottom 1.016: 107.95,43.18 107.95,50.8 IC3.2 | IC3.5 107.95,43.18 | 107.95,43.18 94.61,29.84 94.61,6.35 129.54,6.35 133.35,10.16 133.35,13.97 SV5.2
N$37
  Bottom 1.016: LED4.A R9.2
N$38
  Bottom 0.813: 0,0 0,100.33 160.02,100.33 160.02,0 0,0
N$39
  Top 0.813: 0,0 0,100.33 160.02,100.33 160.02,0 0,0
VCC  (via drill 0.6 pad 1.42)
  Top 1.016: v142.24,26.67 IC1.16 | R7.1 20.32,63.5 24.13,59.69 24.13,38.1 R4.2 | IC6.14 54.61,58.42 62.23,66.04 62.23,80.01 60.96,81.28 IC5.14 58.42,85.09 C9.1 57.15,88.9 73.66,88.9 | C4.1 116.84,94.61 99.06,94.61 | 99.06,94.61 C12.1 | 99.06,94.61 79.38,94.61 73.66,88.9 | 73.66,88.9 C10.1
  Bottom 1.016: 59.59,16.51 K2.1 63.5,13.97 D1.C | 59.59,16.51 K1.1 62.23,19.05 D2.C | X1.A30 X1.C30 C5.+ v142.24,26.67 | R4.2 22.86,35.56 | 22.86,35.56 R3.2 44.45,27.94 50.8,21.59 50.8,16.51 59.59,16.51 | C4.1 118.11,92.71 IC2.20 135.89,88.9 140.34,84.45 C7.+ X1.C3 X1.A3 157.48,84.45 157.48,71.75 X1.A8 X1.C8 143.51,71.75 135.89,57.15 129.54,57.15 | C3.1 118.11,57.15 | 118.11,57.15 IC3.14 | IC1.16 118.11,30.48 | 118.11,30.48 C2.1 | 118.11,57.15 129.54,57.15 | IC7.20 100.33,92.71 C12.1 | IC6.14 50.8,57.15 C11.1 44.45,55.88 35.56,46.99 10.16,46.99 5.08,41.91 5.08,35.56 22.86,35.56 | 129.54,57.15 129.54,41.91 118.11,30.48 | X3.1 15.24,63.42 R7.1 | C9.1 58.42,85.09 IC5.14 | C10.1 74.93,85.09 IC4.14

### Text on the board
Top: Input | Inv. signal | * | Sync. status | Time signal | * | +5V | GND | Pull-Up | Signal | Output -> | Output <- | Clock | Addr. sel. 1 | Addr. sel. 2 | * | * | Jumper default position | <-- Ext. Power supply | *
Bottom: Clock module | Robin Tönniges | 05/2017